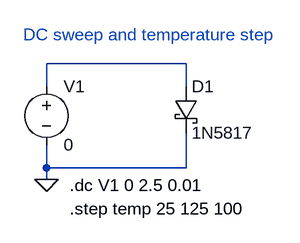
[diagram p0: schematic LTspice 03-3 dc sweep step temp.asc]
LTspice 03-3 dc sweep step temp.asc, the LTspice schematic file:
Version 4
SHEET 1 1576 680
WIRE 544 208 352 208
WIRE 352 240 352 208
WIRE 544 240 544 208
WIRE 352 352 352 320
WIRE 544 352 544 304
WIRE 544 352 352 352
WIRE 352 368 352 352
FLAG 352 368 0
SYMBOL voltage 352 224 R0
WINDOW 123 0 0 Left 2
WINDOW 39 0 0 Left 2
SYMATTR InstName V1
SYMATTR Value 0
SYMBOL schottky 528 240 R0
SYMATTR InstName D1
SYMATTR Value 1N5817
SYMATTR Description Diode
SYMATTR Type diode
TEXT 320 168 Left 2 ;DC sweep and temperature step
TEXT 384 376 Left 2 !.dc V1 0 2.5 0.01
TEXT 384 408 Left 2 !.step temp 25 125 100

The netlist it stands for:
* LTspice 03-3 dc sweep step temp.asc
V1 N001 0 0
D1 N001 0 1N5817
.model D D
.lib standard.dio
* DC sweep and temperature step
.dc V1 0 2.5 0.01
.step temp 25 125 100
.backanno
.end